# Altium schematic sheet Sheet_1.schdoc
size 193 x 162 mm
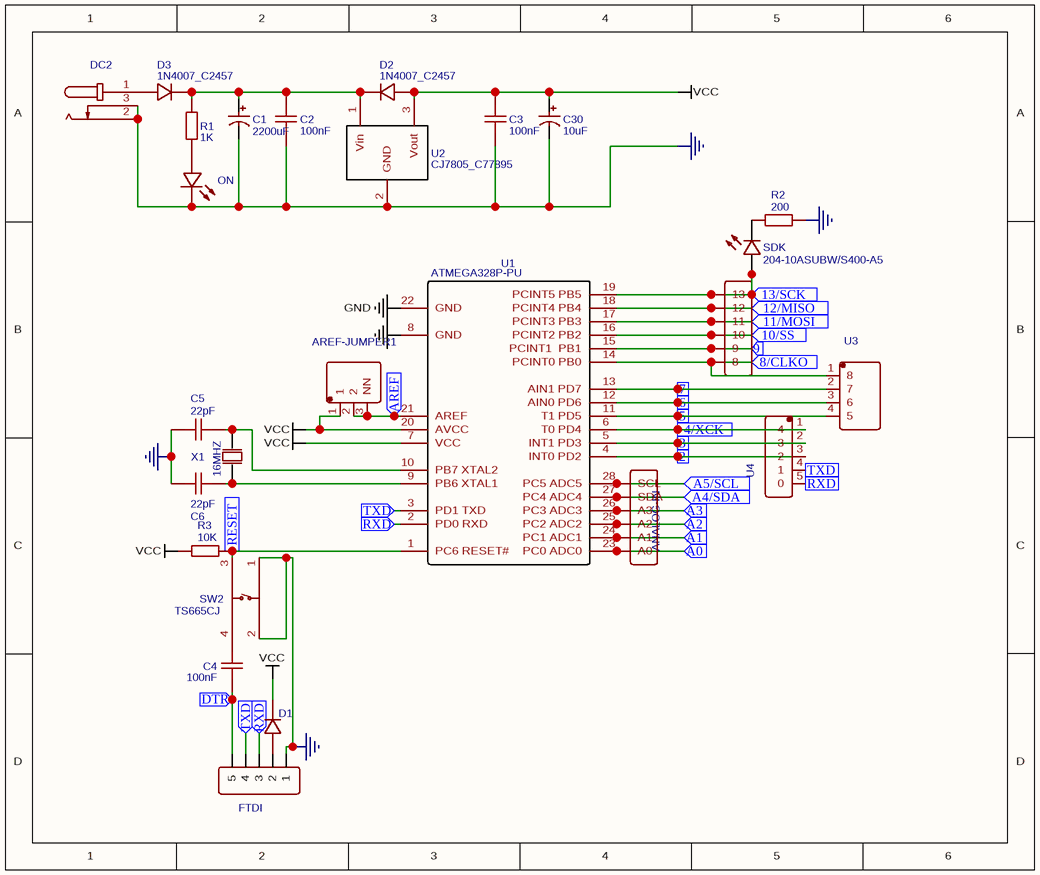
[diagram p0: Sheet_1.schdoc]

## Parts
ANALOG-IN  Header-Male-2.54_1x6  [HDR-TH_6P-P2.54-V]  (value not drawn)
AREF-JUMPER1  MTP125-1103S1  [HDR-TH_3P-P2.54-V]  (value not drawn)
C1  2200uF  [CAP-TH_BD12.5-P5.00-D1.2-FD]
C2  100nF  [CAP-TH_L5.3-W3.8-P5.08-D0.5]
C3  100nF  [CAP-TH_L5.3-W3.8-P5.08-D0.5]
C4  100nF  [CAP-TH_L5.3-W3.8-P5.08-D0.5]
C5  22pF  [CAP-CT4G-0805-2.54MM]
C6  22pF  [CAP-CT4G-0805-2.54MM]
C30  10uF  [CAP-TH_BD5.0-P2.00-D0.8-FD]
D1  1N4007_C2457  [DO-41_BD2.4-L4.7-P8.70-D0.9-RD]  (value not drawn)
D2  1N4007_C2457  [DO-41_BD2.4-L4.7-P8.70-D0.9-RD]
D3  1N4007_C2457  [DO-41_BD2.4-L4.7-P8.70-D0.9-RD]
DC2  DC-002-2.0A-1.3  [DC-IN-TH_DC-002-2.0A-1.3]  (value not drawn)
FTDI  Header-Female-2.54_1x5  [HDR-5X1/2.54]  (value not drawn)
H1  Header-Male-2.54_1x6  [HDR-TH_6P-P2.54-V]  (value not drawn)
ON  LTL-4234  [LED-TH_BD5.0-P2.54-FD]  (value not drawn)
R1  1K  [RES-TH_BD2.3-L6.5-P10.50-D0.5]
R2  200  [RES-TH_BD2.3-L6.5-P10.50-D0.5]
R3  10K  [RES-TH_BD2.2-L6.5-P10.50-D0.9]
SDK  204-10ASUBW/S400-A5  [LED-TH_BD3.0-P2.54-FD]
SW2  TS665CJ  [SW-TH_4P-L6.0-W6.0-P4.50-LS6.5]
U1  ATMEGA328P-PU  [DIP-28_L34.6-W7.3-P2.54-LS10.2-BL]
U2  CJ7805_C77895  [TO-220-3_L10.0-W4.5-P2.54-L]
U3  MTP125-1104S1  [HDR-TH_4P-P2.54-V]  (value not drawn)
U4  MTP125-1105S1  [HDR-TH_5P-P2.54-V]  (value not drawn)
X1  16MHZ  [OSC-49S-1]

## Ports
2 (in), 3 (in), 4/XCK (in), 5 (in), 6 (in), 7 (in), 8/CLKO (in), 9 (in), 10/SS (in), 11/MOSI (in), 12/MISO (in), 13/SCK (in), A0 (in), A1 (in), A2 (in), A3 (in), A4/SDA (in), A5/SCL (in), AREF (in), DTR (in), RESET (in), RXD (in), TXD (in)

## Nets
GND: C1.2 C2.2 C3.2 C5.2 C6.2 C30.2 DC2.2 DC2.3 FTDI.1 ON.2(K) R2.2 SW2.1(A) SW2.2(B) U1.8(GND) U1.22(GND) U2.2(GND)
VCC: AREF-JUMPER1.1 C3.1 C30.1 D1.1(C) D2.2(A) R3.1 U1.7(VCC) U1.20(AVCC) U2.3(Vout)
2: U1.4(INT0_PD2) U4.3(2) ; port 2
3: U1.5(INT1_PD3) U4.2(3) ; port 3
4/XCK: U1.6(T0_PD4) U4.1(4) ; port 4/XCK
5: U1.11(T1_PD5) U3.4(5) ; port 5
6: U1.12(AIN0_PD6) U3.3(6) ; port 6
7: U1.13(AIN1_PD7) U3.2(7) ; port 7
8/CLKO: H1.6(8) U1.14(PCINT0_PB0) U3.1(8) ; port 8/CLKO
9: H1.5(9) U1.15(PCINT1__PB1) ; port 9
10/SS: H1.4(10) U1.16(PCINT2_PB2) ; port 10/SS
11/MOSI: H1.3(11) U1.17(PCINT3_PB3) ; port 11/MOSI
12/MISO: H1.2(12) U1.18(PCINT4_PB4) ; port 12/MISO
13/SCK: H1.1(13) SDK.1(A) U1.19(PCINT5_PB5) ; port 13/SCK
A0: ANALOG-IN.1(A0) U1.23(PC0_ADC0) ; port A0
A1: ANALOG-IN.2(A1) U1.24(PC1_ADC1) ; port A1
A2: ANALOG-IN.3(A2) U1.25(PC2_ADC2) ; port A2
A3: ANALOG-IN.4(A3) U1.26(PC3_ADC3) ; port A3
A4/SDA: ANALOG-IN.5(SDA) U1.27(PC4_ADC4) ; port A4/SDA
A5/SCL: ANALOG-IN.6(SCL) U1.28(PC5_ADC5) ; port A5/SCL
AREF: AREF-JUMPER1.2 AREF-JUMPER1.3(NN) U1.21(AREF) ; port AREF
DTR: C4.2 FTDI.5 ; port DTR
RESET: R3.2 SW2.3(C) U1.1(PC6_RESET#) ; port RESET
RXD: FTDI.3 U1.2(PD0_RXD) U4.5(0) ; port RXD
TXD: FTDI.4 U1.3(PD1_TXD) U4.4(1) ; port TXD
NetC1_1: C1.1 C2.1 D2.1(C) D3.1(C) R1.2 U2.1(Vin)
NetC4_1: C4.1 SW2.4(D)
NetC5_1: C5.1 U1.10(PB7_XTAL2) X1.2(OSC2)
NetC6_1: C6.1 U1.9(PB6_XTAL1) X1.1(OSC1)
NetD1_2: D1.2(A) FTDI.2
NetD3_2: D3.2(A) DC2.1
NetON_1: ON.1(A) R1.1
NetR2_1: R2.1 SDK.2(K)

## Library data of the parts
ANALOG-IN H1 = Header-Male-2.54_1x6: BOM_Manufacturer: BOOMELE; BOM_Supplier: LCSC; BOM_Manufacturer Part: Header-Male-2.54_1x6; BOM_Supplier Part: C37208; spicePre: H; spiceSymbolName: Header-Male-2.54_1x6
AREF-JUMPER1 = MTP125-1103S1: BOM_Manufacturer: MINTRON; Contributor: LCSC; BOM_Supplier: LCSC; BOM_Supplier Part: C358685; BOM_Manufacturer Part: MTP125-1103S1; spicePre: U; spiceSymbolName: MTP125-1103S1
C1 = 2200uF: BOM_Manufacturer: ValuePro; BOM_Manufacturer Part: 2200uf 35v; nameAlias: Capacitance; BOM_Supplier: LCSC; BOM_Supplier Part: C43275; spicePre: C; spiceSymbolName: 2200uf 35v
C2-C4 = 100nF: BOM_Manufacturer: FH; BOM_Manufacturer Part: CT4-0805B104K500F1; nameAlias: Capacitance; Contributor: LCSC; BOM_Supplier: LCSC; BOM_Supplier Part: C168753; spicePre: C; spiceSymbolName: CT4-0805B104K500F1
C5 C6 = 22pF: BOM_Manufacturer: Dersonic; BOM_Manufacturer Part: CC1H220JA1FDCH4B10MF; nameAlias: Capacitance; Contributor: LCSC; BOM_Supplier: LCSC; BOM_Supplier Part: C254096; spicePre: C; spiceSymbolName: CC1H220JA1FDCH4B10MF
C30 = 10uF: BOM_Manufacturer: ValuePro; BOM_Manufacturer Part: 10uF 50V 5*11; nameAlias: Capacitance; BOM_Supplier: LCSC; BOM_Supplier Part: C43345; spicePre: C; spiceSymbolName: 10uF 50V 5*11
D1-D3 = 1N4007_C2457: BOM_Manufacturer: MDD; BOM_Manufacturer Part: 1N4007; BOM_Supplier: LCSC; image: //image.lceda.cn/szlcsc/C2457.jpg; BOM_Supplier Part: C2457; spicePre: D; spiceSymbolName: 1N4007_C2457
DC2 = DC-002-2.0A-1.3: BOM_Manufacturer: XKB Enterprise; Contributor: LCSC; BOM_Supplier: LCSC; BOM_Supplier Part: C381119; BOM_Manufacturer Part: DC-002-2.0A-1.3; spicePre: D
FTDI = Header-Female-2.54_1x5: BOM_Manufacturer: BOOMELE; BOM_Manufacturer Part: 2.54mm 1*5p Female header; BOM_Supplier: LCSC; image: //image.lceda.cn/szlcsc/C50950.jpg; BOM_Supplier Part: C50950; spicePre: H; spiceSymbolName: Header-Female-2.54_1x5
ON = LTL-4234: BOM_Manufacturer: LITEON; Contributor: LCSC; BOM_Supplier: LCSC; BOM_Manufacturer Part: LTL-4234; BOM_Supplier Part: C115447; spicePre: L; spiceSymbolName: LTL-4234
R1 = 1K: BOM_Manufacturer: Chian Chia Elec; nameAlias: Resistance (Ohms); Contributor: LCSC; BOM_Supplier: LCSC; BOM_Supplier Part: C120055; BOM_Manufacturer Part: -; spicePre: R; spiceSymbolName: CF1/4W-1KΩ±5% T52
R2 = 200: BOM_Manufacturer: Chian Chia Elec; nameAlias: Resistance (Ohms); Contributor: LCSC; BOM_Supplier: LCSC; BOM_Supplier Part: C120038; BOM_Manufacturer Part: -; spicePre: R; spiceSymbolName: CF1/4W-200Ω±5% T52
R3 = 10K: BOM_Manufacturer: Chian Chia Elec; nameAlias: Resistance (Ohms); Contributor: LCSC; BOM_Supplier: LCSC; BOM_Supplier Part: C119894; BOM_Manufacturer Part: -; spicePre: R; spiceSymbolName: CF1/6W-10KΩ±5% T52
SDK = 204-10ASUBW/S400-A5: BOM_Manufacturer: EVERLIGHT; BOM_Supplier: LCSC; BOM_Manufacturer Part: 204-10ASUBW/S400-A5; BOM_Supplier Part: C97696; spicePre: L; spiceSymbolName: 204-10ASUBW/S400-A5
SW2 = TS665CJ: BOM_Manufacturer: SHOU HAN; Contributor: LCSC; BOM_Supplier: LCSC; BOM_Supplier Part: C393938; BOM_Manufacturer Part: TS665CJ; spicePre: S; spiceSymbolName: TS665CJ
U1 = ATMEGA328P-PU: BOM_Manufacturer: MICROCHIP; sourceId: Oic6oiASL; Contributor: LCSC; timeStamp: 1451725987; BOM_Supplier: LCSC; BOM_Manufacturer Part: ATMEGA328P-PU; image: //image.lceda.cn/szlcsc/C33901.jpg; BOM_Supplier Part: C33901; spicePre: U
U2 = CJ7805_C77895: BOM_Manufacturer: CJ; BOM_Manufacturer Part: CJ7805; BOM_Supplier: LCSC; image: //image.lceda.cn/szlcsc/C77895.jpg; BOM_Supplier Part: C77895; spicePre: U
U3 = MTP125-1104S1: BOM_Manufacturer: MINTRON; Contributor: LCSC; BOM_Supplier: LCSC; BOM_Supplier Part: C358686; BOM_Manufacturer Part: MTP125-1104S1; spicePre: U; spiceSymbolName: MTP125-1104S1
U4 = MTP125-1105S1: BOM_Manufacturer: MINTRON; Contributor: LCSC; BOM_Supplier: LCSC; BOM_Supplier Part: C358687; BOM_Manufacturer Part: MTP125-1105S1; spicePre: U; spiceSymbolName: MTP125-1105S1
X1 = 16MHZ: BOM_Manufacturer: YXC; BOM_Manufacturer Part: X49SD16MSD2SC; Value: 16MHZ; BOM_Supplier: LCSC; spicePre: X; BOM_Supplier Part: C16212